# EAGLE schematic nesphone (EAGLE 7.5.0)
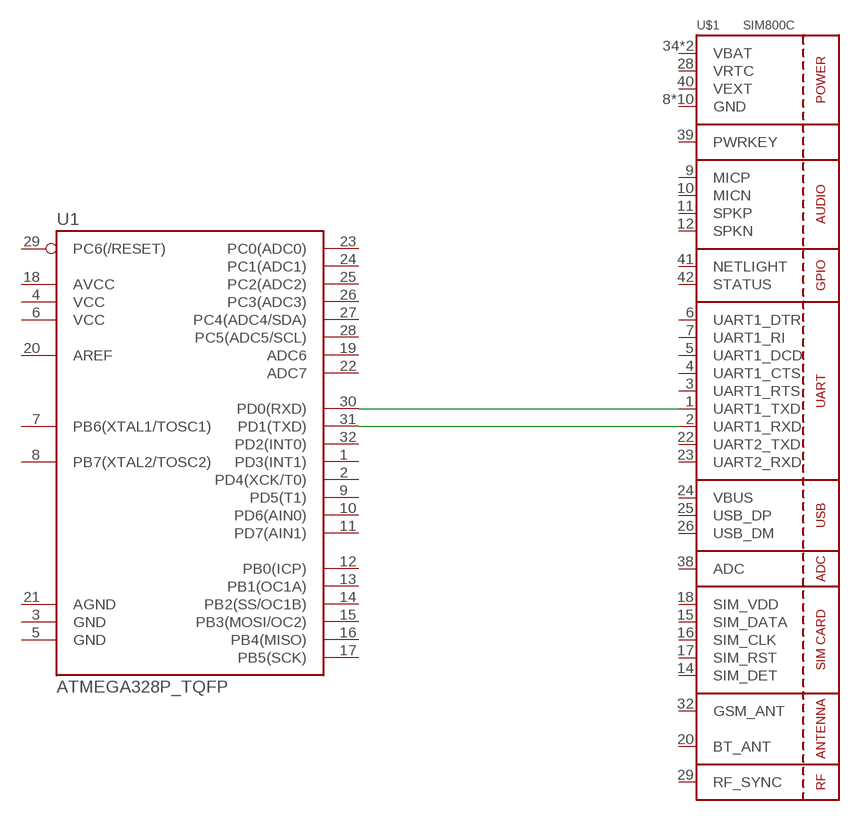
[diagram p0: schematic, sheet 1]

## Parts
U1  ATMEGA328P_TQFP  [TQFP32-08]
U$1  SIM800C  [SIM800C]

## Nets
N$1: U1.30(PD0(RXD)) U$1.1(UART1_TXD)
N$2: U1.31(PD1(TXD)) U$1.2(UART1_RXD)
Unconnected: U1.1(PD3(INT1)) U1.2(PD4(XCK/T0)) U1.3(GND) U1.4(VCC) U1.5(GND) U1.6(VCC) U1.7(PB6(XTAL1/TOSC1)) U1.8(PB7(XTAL2/TOSC2)) U1.9(PD5(T1)) U1.10(PD6(AIN0)) U1.11(PD7(AIN1)) U1.12(PB0(ICP)) U1.13(PB1(OC1A)) U1.14(PB2(SS/OC1B)) U1.15(PB3(MOSI/OC2)) U1.16(PB4(MISO)) U1.17(PB5(SCK)) U1.18(AVCC) U1.19(ADC6) U1.20(AREF) U1.21(AGND) U1.22(ADC7) U1.23(PC0(ADC0)) U1.24(PC1(ADC1)) U1.25(PC2(ADC2)) U1.26(PC3(ADC3)) U1.27(PC4(ADC4/SDA)) U1.28(PC5(ADC5/SCL)) U1.29(PC6(/RESET)) U1.32(PD2(INT0)) U$1.3(UART1_RTS) U$1.4(UART1_CTS) U$1.5(UART1_DCD) U$1.6(UART1_DTR) U$1.7(UART1_RI) U$1.9(MICP) U$1.10(MICN) U$1.11(SPKP) U$1.12(SPKN) U$1.14(SIM_DET) U$1.15(SIM_DATA) U$1.16(SIM_CLK) U$1.17(SIM_RST) U$1.20(BT_ANT) U$1.22(UART2_TXD) U$1.23(UART2_RXD) U$1.25(USB_DP) U$1.26(USB_DM) U$1.29(RF_SYNC) U$1.32(GSM_ANT) U$1.38(ADC) U$1.39(PWRKEY) U$1.41(NETLIGHT) U$1.42(STATUS)

## Power pins joined to a net without a drawn wire
GND: U$1.8(GND) U$1.13(GND) U$1.19(GND) U$1.21(GND) U$1.27(GND) U$1.30(GND) U$1.31(GND) U$1.33(GND) U$1.36(GND) U$1.37(GND)
SIM_VDD: U$1.18(SIM_VDD)
VBAT: U$1.34(VBAT) U$1.35(VBAT)
VBUS: U$1.24(VBUS)
VEXT: U$1.40(VEXT)
VRTC: U$1.28(VRTC)

## Library data of the parts
U1 = SparkFun-DigitalIC:ATMEGA328P_TQFP; PROD_ID: IC-09069
U$1 = SIM800C:SIM800C

## Net classes
0 default: clearance 0.205 mm